# Altium schematic sheet QIMS.SchDoc
size A4
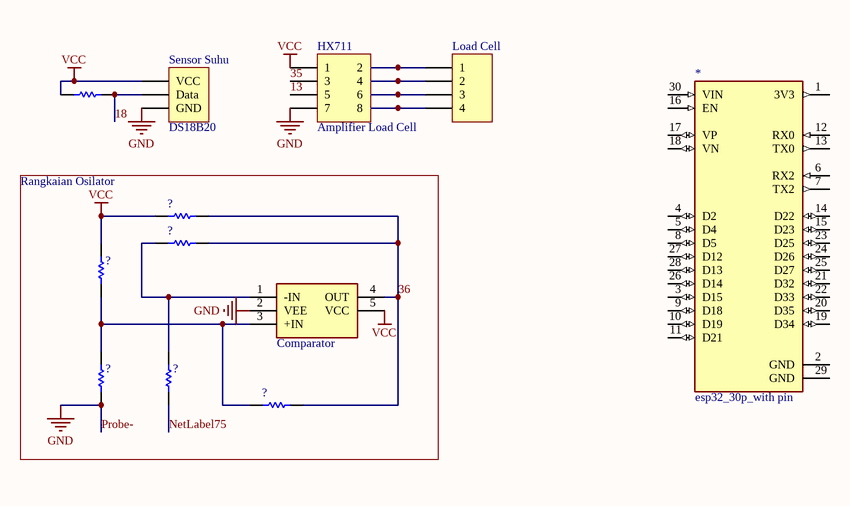
[diagram p0: QIMS.SchDoc]

## Parts
(Parts that share a designator on the sheet are numbered #1, #2 ... from top to bottom, then left to right.)
*  esp32_30p_with pin  [esp32_30p_with pin]
?#1  (no value)  [Resistor 0.5W]
?#2  (no value)  [Resistor 0.5W]
?#3  (no value)  [Resistor 0.5W]
?#4  (no value)  [Resistor 0.5W]
?#5  Comparator  [SOT95P280X125-5N]
?#6  (no value)  [Resistor 0.5W]
?#7  (no value)  [Resistor 0.5W]
?#8  (no value)  [Resistor 0.5W]
HX711  Amplifier Load Cell  [Header 4x2 Male]
Load_Cell  (no value)  [Header 4 Male]
Sensor_Suhu  DS18B20  [Header 3 Male]

## Blocks framed on the sheet
Rangkaian Osilator: ?#2-?#8

## Nets
Probe-: ?#5.2(VEE) ?#6.1 HX711.7 Sensor_Suhu.3(GND)  [also labelled GND]
VCC: ?#1.1 ?#2.1 ?#4.2 ?#5.5(VCC) HX711.1 Sensor_Suhu.1(VCC)
13: HX711.5
18: ?#1.2 Sensor_Suhu.2(Data)
35: HX711.3
36: ?#2.2 ?#3.2 ?#5.4(OUT) ?#8.2
NetLabel75: ?#7.1
Net?#3_1: ?#3.1 ?#5.1(-IN) ?#7.2
Net?#4_1: ?#4.1 ?#5.3(+IN) ?#6.2 ?#8.1
NetHX711_2: HX711.2 Load_Cell.1
NetHX711_4: HX711.4 Load_Cell.2
NetHX711_6: HX711.6 Load_Cell.3
NetHX711_8: HX711.8 Load_Cell.4

Not connected (* = marked no-connect by the designer): * 1(3V3) 2(GND) 3(D15) 4(D2) 5(D4) 6(RX2) 7(TX2) 8(D5) 9(D18) 10(D19) 11(D21) 12(RX0) 13(TX0) 14(D22) 15(D23) 16(EN) 17(VP) 18(VN) 19(D34) 20(D35) 21(D32) 22(D33) 23(D25) 24(D26) 25(D27) 26(D14) 27(D12) 28(D13) 29(GND) 30(VIN)

## Library data of the parts
?#1-?#4 ?#6-?#8 = Resistor 0.5W
?#5 = BA8391G-TR: Integrated Circuit; Manufacturer_Name: ROHM Semiconductor; Datasheet Link: https://datasheet.datasheetarchive.com/originals/distributors/Datasheets_SAMA/b24f2bf9c79b34b4eb86dbe6260b2e34.pdf; Height: 1.25mm; Manufacturer_Part_Number: BA8391G-TR; Mouser Part Number: 755-BA8391G-TR; Mouser Price/Stock: https://www.mouser.co.uk/ProductDetail/ROHM-Semiconductor/BA8391G-TR?qs=IDm2WsMLa1U8RB2%2FoBA3QQ%3D%3D
HX711 = Header 4x2 Male
Load_Cell = Header 4 Male
Sensor_Suhu = Header 3 Male